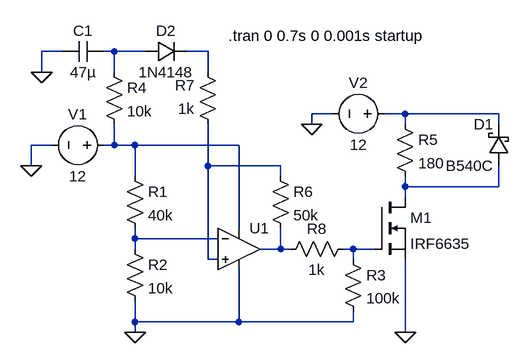
[diagram p0: schematic turn on delay2.asc]
turn on delay2.asc, the LTspice schematic file:
Version 4
SHEET 1 880 680
WIRE -64 -48 -96 -48
WIRE 16 -48 0 -48
WIRE 64 -48 16 -48
WIRE 160 -48 128 -48
WIRE -96 -16 -96 -48
WIRE 16 -16 16 -48
WIRE 160 -16 160 -48
WIRE 352 48 320 48
WIRE 464 48 432 48
WIRE 608 48 464 48
WIRE 320 64 320 48
WIRE 464 64 464 48
WIRE 608 64 608 48
WIRE -80 96 -112 96
WIRE 16 96 16 64
WIRE 16 96 0 96
WIRE 48 96 16 96
WIRE 208 96 48 96
WIRE -112 128 -112 96
WIRE 160 128 160 64
WIRE 272 128 160 128
WIRE 48 144 48 96
WIRE 272 144 272 128
WIRE 464 160 464 144
WIRE 608 160 608 128
WIRE 608 160 464 160
WIRE 464 176 464 160
WIRE 208 224 208 96
WIRE 48 240 48 224
WIRE 176 240 48 240
WIRE 48 256 48 240
WIRE 272 256 272 224
WIRE 272 256 240 256
WIRE 288 256 272 256
WIRE 384 256 368 256
WIRE 416 256 384 256
WIRE 160 272 160 128
WIRE 176 272 160 272
WIRE 384 272 384 256
WIRE 48 368 48 336
WIRE 208 368 208 288
WIRE 208 368 48 368
WIRE 384 368 384 352
WIRE 384 368 208 368
WIRE 48 384 48 368
WIRE 464 384 464 272
FLAG -112 128 0
FLAG 48 384 0
FLAG -96 -16 0
FLAG 464 384 0
FLAG 320 64 0
SYMBOL voltage 16 96 R90
WINDOW 0 -32 56 VBottom 2
WINDOW 3 32 56 VTop 2
WINDOW 123 0 0 Left 2
WINDOW 39 0 0 Left 2
SYMATTR InstName V1
SYMATTR Value 12
SYMBOL res 32 128 R0
SYMATTR InstName R1
SYMATTR Value 40k
SYMBOL res 32 240 R0
SYMATTR InstName R2
SYMATTR Value 10k
SYMBOL Opamps\\UniversalOpamp2 208 256 R0
SYMATTR InstName U1
SYMBOL cap 0 -64 R90
WINDOW 0 0 32 VBottom 2
WINDOW 3 32 32 VTop 2
SYMATTR InstName C1
SYMATTR Value 47µ
SYMBOL res 0 -32 R0
SYMATTR InstName R4
SYMATTR Value 10k
SYMBOL res 256 128 R0
SYMATTR InstName R6
SYMATTR Value 50k
SYMBOL res 176 80 R180
WINDOW 0 36 76 Left 2
WINDOW 3 36 40 Left 2
SYMATTR InstName R7
SYMATTR Value 1k
SYMBOL res 448 48 R0
SYMATTR InstName R5
SYMATTR Value 180
SYMBOL voltage 448 48 R90
WINDOW 0 -32 56 VBottom 2
WINDOW 3 32 56 VTop 2
WINDOW 123 0 0 Left 2
WINDOW 39 0 0 Left 2
SYMATTR InstName V2
SYMATTR Value 12
SYMBOL nmos 416 176 R0
SYMATTR InstName M1
SYMATTR Value IRF6635
SYMBOL res 368 256 R0
SYMATTR InstName R3
SYMATTR Value 100k
SYMBOL res 384 240 R90
WINDOW 0 0 56 VBottom 2
WINDOW 3 32 56 VTop 2
SYMATTR InstName R8
SYMATTR Value 1k
SYMBOL schottky 624 128 R180
WINDOW 0 24 64 Left 2
WINDOW 3 24 0 Left 2
SYMATTR InstName D1
SYMATTR Value B540C
SYMATTR Description Diode
SYMATTR Type diode
SYMBOL diode 64 -32 R270
WINDOW 0 32 32 VTop 2
WINDOW 3 0 32 VBottom 2
SYMATTR InstName D2
SYMATTR Value 1N4148
TEXT 192 -72 Left 2 !.tran 0 0.7s 0 0.001s startup

The netlist it stands for:
* turn on delay2.asc
V1 N004 0 12
R1 N004 N007 40k
R2 N007 0 10k
XU1 N005 N007 N004 0 N008 level.2 Avol=1Meg GBW=10Meg Slew=10Meg ilimit=25m rail=0 Vos=0 phimargin=45 en=0 enk=0 in=0 ink=0 Rin=500Meg  ; pins IN+ IN- V+ V- OUT
C1 N001 0 47µ
R4 N001 N004 10k
R6 N005 N008 50k
R7 N005 N002 1k
R5 N003 N006 180
V2 N003 0 12
M1 N006 N009 0 0 IRF6635
R3 N009 0 100k
R8 N009 N008 1k
D1 N006 N003 B540C
D2 N001 N002 1N4148
.model D D
.lib standard.dio
.model NMOS NMOS
.model PMOS PMOS
.lib standard.mos
.tran 0 0.7s 0 0.001s startup
.lib UniversalOpamps2.sub
.backanno
.end